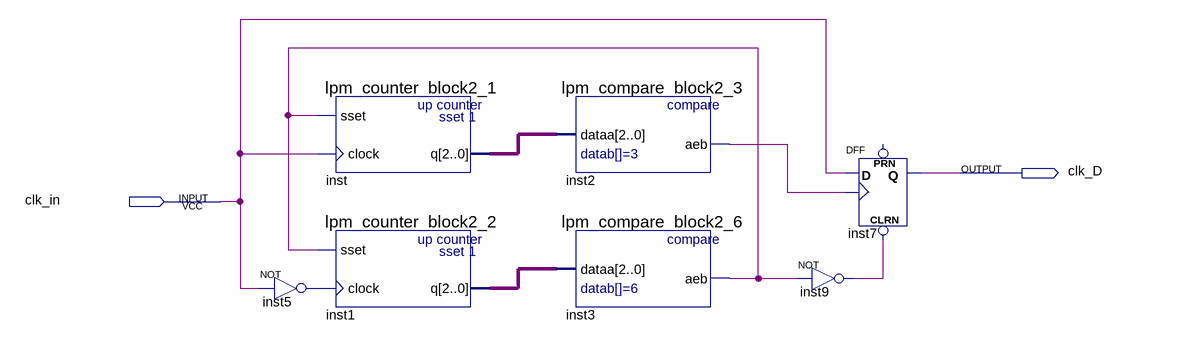
[diagram p0: schematic sheet]
// Quartus schematic Block2.bdf as structural Verilog: 7 symbols, 2 pins
module Block2 (
  input  clk_in,
  output clk_D
);

  wire inst2_aeb, inst3_aeb, inst5_out, inst9_out;
  wire [2:0] inst1_q, inst_q;

  lpm_counter_block2_1 inst (.sset(inst3_aeb), .clock(clk_in), .q(inst_q));
  lpm_counter_block2_2 inst1 (.sset(inst3_aeb), .clock(inst5_out), .q(inst1_q));
  not inst5 (inst5_out, clk_in);
  lpm_compare_block2_3 inst2 (.dataa(inst_q), .aeb(inst2_aeb));
  lpm_compare_block2_6 inst3 (.dataa(inst1_q), .aeb(inst3_aeb));
  DFF inst7 (.CLRN(inst9_out), .CLK(inst2_aeb), .D(clk_in), .Q(clk_D));  // open: PRN
  not inst9 (inst9_out, inst3_aeb);
endmodule
